# Altium schematic sheet NRF_Transciever.SchDoc: NRF_BLE_DEV_BOARD
size 420 x 297 mm; Date: 10/14/2025; Author: Nandish K K; DrawnBy: Nandish K K; Engineer: Nandish K K; Organization: github.com/Nandish-KK; Revision: A; SheetNumber: 1; SheetTotal: 1; Time: 3:41 AM
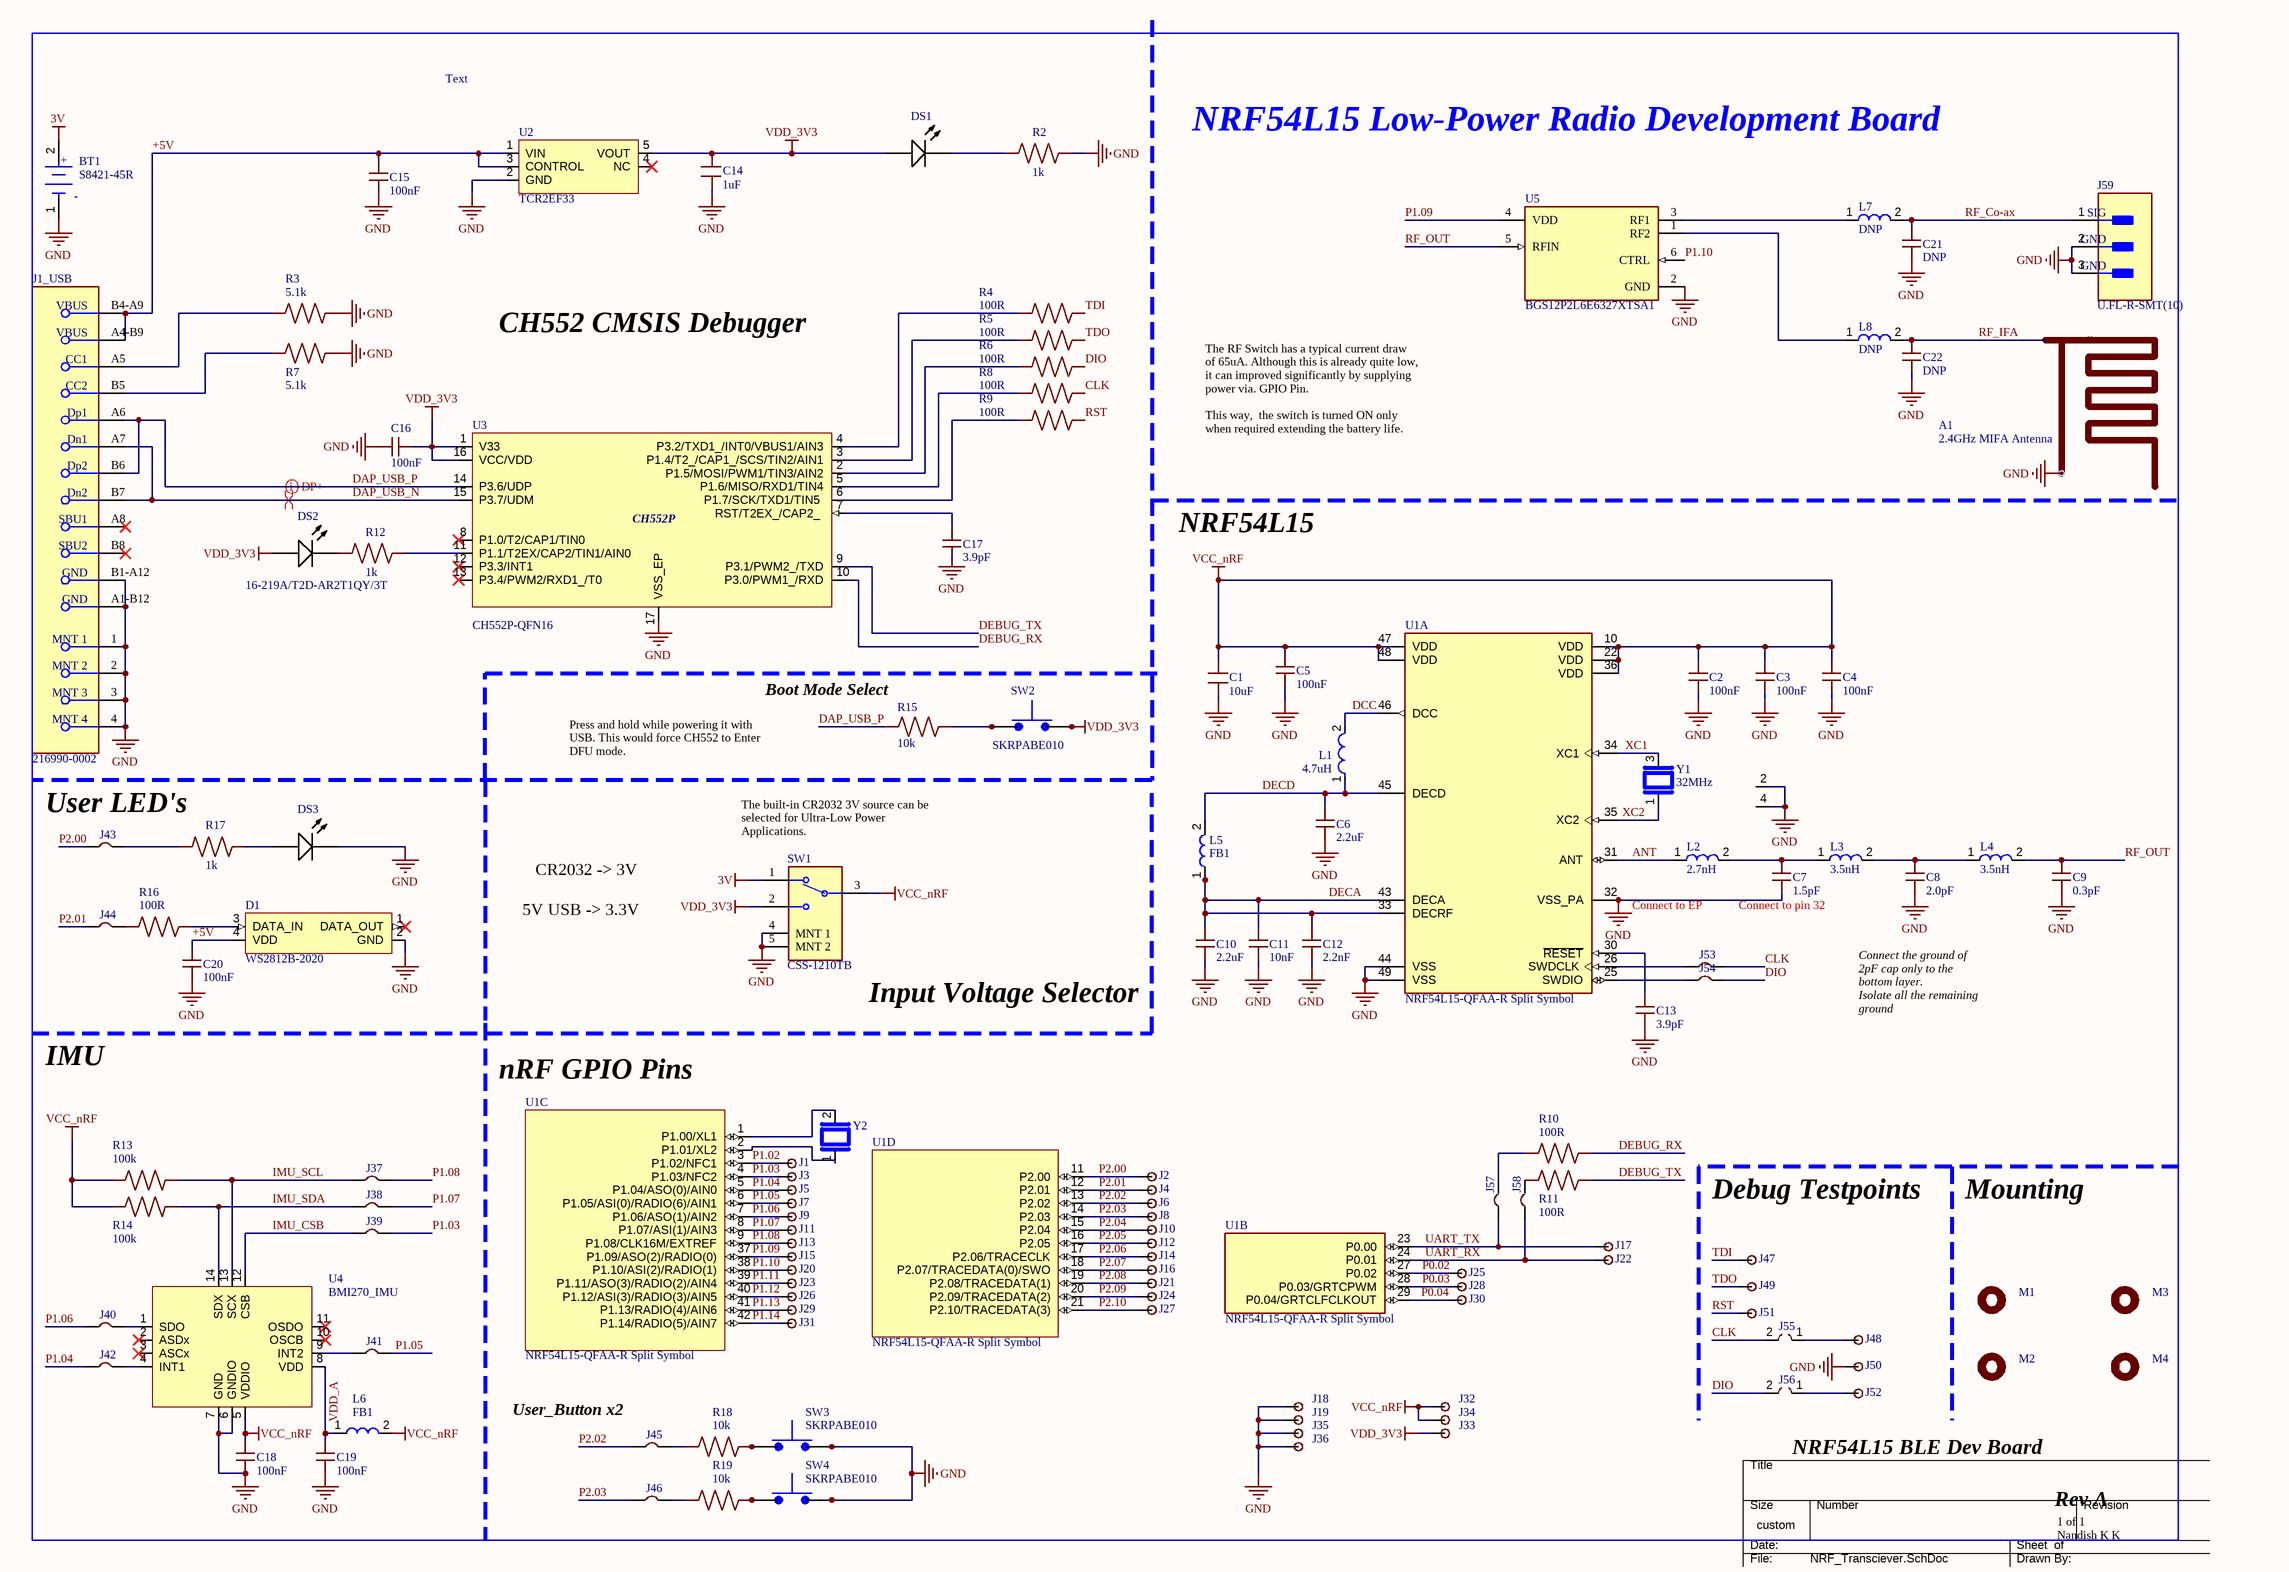
[diagram p0: NRF_Transciever.SchDoc]

## Parts
A1  2.4GHz MIFA Antenna  [2.4GHz MIFA]
BT1  S8421-45R  [FP-S8421-45R-MFG]
C1  10uF  [0402_SMD_CAPACITOR]
C2  100nF  [0201 SMD Capacitor]
C3  100nF  [0201 SMD Capacitor]
C4  100nF  [0201 SMD Capacitor]
C5  100nF  [0201 SMD Capacitor]
C6  2.2uF  [0201 SMD Capacitor]
C7  1.5pF  [0201 SMD Capacitor]
C8  2.0pF  [0201 SMD Capacitor]
C9  0.3pF  [0201 SMD Capacitor]
C10  2.2uF  [0201 SMD Capacitor]
C11  10nF  [0201 SMD Capacitor]
C12  2.2nF  [0201 SMD Capacitor]
C13  3.9pF  [0201 SMD Capacitor]
C14  1uF  [0402_SMD_CAPACITOR]
C15  100nF  [0201 SMD Capacitor]
C16  100nF  [0201 SMD Capacitor]
C17  3.9pF  [0201 SMD Capacitor]
C18  100nF  [0201 SMD Capacitor]
C19  100nF  [0201 SMD Capacitor]
C20  100nF  [0201 SMD Capacitor]
C21  DNP  [0201 SMD Capacitor]
C22  DNP  [0201 SMD Capacitor]
D1  WS2812B-2020  [ws2812b-2020]
DS1  16-219A/T2D-AR2T1QY/3T  [EVRL-0402-2_V]  (value not drawn)
DS2  16-219A/T2D-AR2T1QY/3T  [EVRL-0402-2_V]
DS3  16-219A/T2D-AR2T1QY/3T  [EVRL-0402-2_V]  (value not drawn)
J1  Single_Header_2.54mm  [Single_Header_2.54mm]  (value not drawn)
J1_USB  216990-0002  [FP-216990-0002-MFG]
J2  Single_Header_2.54mm  [Single_Header_2.54mm]  (value not drawn)
J3  Single_Header_2.54mm  [Single_Header_2.54mm]  (value not drawn)
J4  Single_Header_2.54mm  [Single_Header_2.54mm]  (value not drawn)
J5  Single_Header_2.54mm  [Single_Header_2.54mm]  (value not drawn)
J6  Single_Header_2.54mm  [Single_Header_2.54mm]  (value not drawn)
J7  Single_Header_2.54mm  [Single_Header_2.54mm]  (value not drawn)
J8  Single_Header_2.54mm  [Single_Header_2.54mm]  (value not drawn)
J9  Single_Header_2.54mm  [Single_Header_2.54mm]  (value not drawn)
J10  Single_Header_2.54mm  [Single_Header_2.54mm]  (value not drawn)
J11  Single_Header_2.54mm  [Single_Header_2.54mm]  (value not drawn)
J12  Single_Header_2.54mm  [Single_Header_2.54mm]  (value not drawn)
J13  Single_Header_2.54mm  [Single_Header_2.54mm]  (value not drawn)
J14  Single_Header_2.54mm  [Single_Header_2.54mm]  (value not drawn)
J15  Single_Header_2.54mm  [Single_Header_2.54mm]  (value not drawn)
J16  Single_Header_2.54mm  [Single_Header_2.54mm]  (value not drawn)
J17  Single_Header_2.54mm  [Single_Header_2.54mm]  (value not drawn)
J18  Single_Header_2.54mm  [Single_Header_2.54mm]  (value not drawn)
J19  Single_Header_2.54mm  [Single_Header_2.54mm]  (value not drawn)
J20  Single_Header_2.54mm  [Single_Header_2.54mm]  (value not drawn)
J21  Single_Header_2.54mm  [Single_Header_2.54mm]  (value not drawn)
J22  Single_Header_2.54mm  [Single_Header_2.54mm]  (value not drawn)
J23  Single_Header_2.54mm  [Single_Header_2.54mm]  (value not drawn)
J24  Single_Header_2.54mm  [Single_Header_2.54mm]  (value not drawn)
J25  Single_Header_2.54mm  [Single_Header_2.54mm]  (value not drawn)
J26  Single_Header_2.54mm  [Single_Header_2.54mm]  (value not drawn)
J27  Single_Header_2.54mm  [Single_Header_2.54mm]  (value not drawn)
J28  Single_Header_2.54mm  [Single_Header_2.54mm]  (value not drawn)
J29  Single_Header_2.54mm  [Single_Header_2.54mm]  (value not drawn)
J30  Single_Header_2.54mm  [Single_Header_2.54mm]  (value not drawn)
J31  Single_Header_2.54mm  [Single_Header_2.54mm]  (value not drawn)
J32  Single_Header_2.54mm  [Single_Header_2.54mm]  (value not drawn)
J33  Single_Header_2.54mm  [Single_Header_2.54mm]  (value not drawn)
J34  Single_Header_2.54mm  [Single_Header_2.54mm]  (value not drawn)
J35  Single_Header_2.54mm  [Single_Header_2.54mm]  (value not drawn)
J36  Single_Header_2.54mm  [Single_Header_2.54mm]  (value not drawn)
J37  Shorted_Solder_Bridge  [SHORTED_SOLDER_BRIDGE]  (value not drawn)
J38  Shorted_Solder_Bridge  [SHORTED_SOLDER_BRIDGE]  (value not drawn)
J39  Shorted_Solder_Bridge  [SHORTED_SOLDER_BRIDGE]  (value not drawn)
J40  Shorted_Solder_Bridge  [SHORTED_SOLDER_BRIDGE]  (value not drawn)
J41  Shorted_Solder_Bridge  [SHORTED_SOLDER_BRIDGE]  (value not drawn)
J42  Shorted_Solder_Bridge  [SHORTED_SOLDER_BRIDGE]  (value not drawn)
J43  Shorted_Solder_Bridge  [SHORTED_SOLDER_BRIDGE]  (value not drawn)
J44  Shorted_Solder_Bridge  [SHORTED_SOLDER_BRIDGE]  (value not drawn)
J45  Shorted_Solder_Bridge  [SHORTED_SOLDER_BRIDGE]  (value not drawn)
J46  Shorted_Solder_Bridge  [SHORTED_SOLDER_BRIDGE]  (value not drawn)
J47  Single_Header_2.54mm  [Single_Header_2.54mm]  (value not drawn)
J48  Single_Header_2.54mm  [Single_Header_2.54mm]  (value not drawn)
J49  Single_Header_2.54mm  [Single_Header_2.54mm]  (value not drawn)
J50  Single_Header_2.54mm  [Single_Header_2.54mm]  (value not drawn)
J51  Single_Header_2.54mm  [Single_Header_2.54mm]  (value not drawn)
J52  Single_Header_2.54mm  [Single_Header_2.54mm]  (value not drawn)
J53  Shorted_Solder_Bridge  [SHORTED_SOLDER_BRIDGE]  (value not drawn)
J54  Shorted_Solder_Bridge  [SHORTED_SOLDER_BRIDGE]  (value not drawn)
J55  Open_Solder_Bridge  [Open_Solder_bridge]  (value not drawn)
J56  Open_Solder_Bridge  [Open_Solder_bridge]  (value not drawn)
J57  Shorted_Solder_Bridge  [SHORTED_SOLDER_BRIDGE]  (value not drawn)
J58  Shorted_Solder_Bridge  [SHORTED_SOLDER_BRIDGE]  (value not drawn)
J59  U.FL-R-SMT(10)  [FP-U_FL-R-SMT_10-MFG]
L1  4.7uH  [FP-MLZ1608-IPC_A]
L2  2.7nH  [0201_SMD_INDUCTOR]
L3  3.5nH  [0201_SMD_INDUCTOR]
L4  3.5nH  [0201_SMD_INDUCTOR]
L5  FB1  [0201_SMD_INDUCTOR]
L6  FB1  [0201_SMD_INDUCTOR]
L7  DNP  [0201_SMD_INDUCTOR]
L8  DNP  [0201_SMD_INDUCTOR]
M1  M2_Mounting_Hole  [M2 Mounting hole]  (value not drawn)
M2  M2_Mounting_Hole  [M2 Mounting hole]  (value not drawn)
M3  M2_Mounting_Hole  [M2 Mounting hole]  (value not drawn)
M4  M2_Mounting_Hole  [M2 Mounting hole]  (value not drawn)
R2  1k  [RES_0402_Generic]
R3  5.1k  [RES_0402_Generic]
R4  100R  [RES_0402_Generic]
R5  100R  [RES_0402_Generic]
R6  100R  [RES_0402_Generic]
R7  5.1k  [RES_0402_Generic]
R8  100R  [RES_0402_Generic]
R9  100R  [RES_0402_Generic]
R10  100R  [RES_0402_Generic]
R11  100R  [RES_0402_Generic]
R12  1k  [RES_0402_Generic]
R13  100k  [RES_0402_Generic]
R14  100k  [RES_0402_Generic]
R15  10k  [RES_0402_Generic]
R16  100R  [RES_0402_Generic]
R17  1k  [RES_0402_Generic]
R18  10k  [RES_0402_Generic]
R19  10k  [RES_0402_Generic]
SW1  CSS-1210TB  [FP-CSS-1210TB-MFG]
SW2  SKRPABE010  [SW_SKRPABE010]
SW3  SKRPABE010  [SW_SKRPABE010]
SW4  SKRPABE010  [SW_SKRPABE010]
U1  NRF54L15-QFAA-R Split Symbol  [NRF54L15_LQFN_48]  (parts A,B,C,D of 4)
U2  TCR2EF33  [TCR2EF33-SOT-23-5]
U3  CH552P-QFN16  [CH552-QFN16_3x3]
U4  BMI270_IMU  [BMI_270_PQFN50P300X250X70-14L]
U5  BGS12P2L6E6327XTSA1  [FP-PG-TSLP-6-MFG]
Y1  32MHz  [OSC_XRCGB32M000F2P01R0]
Y2  CM8V-T1A-32.768KHZ-9PF-20PPM-TA-QC  [XTAL_CM8V-T1A-32.768KHZ-9PF-20PPM-TA-QC]  (value not drawn)

## Nets
3V: BT1.2(A) SW1.1
GND: A1.2(GND) BT1.1(C) C1.1 C2.1 C3.1 C4.1 C5.1 C6.1 C7.1 C8.1 C9.1 C10.1 C11.1 C12.1 C13.1 C14.1 C15.1 C16.1 C17.1 C18.1 C19.1 C20.1 C21.1 C22.1 D1.2(GND) DS3.2(K) J1_USB.1(MNT_1) J1_USB.2(MNT_2) J1_USB.3(MNT_3) J1_USB.4(MNT_4) J1_USB.A1-B12(GND) J1_USB.B1-A12(GND) J18.1 J19.1 J35.1 J36.1 J50.1 J59.2(GND) J59.3(GND) R2.1 R3.1 R7.1 SW1.4(MNT_1) SW1.5(MNT_2) SW3.3 SW3.4 SW4.3 SW4.4 U1.32(VSS_PA) U1.44(VSS) U1.49(VSS) U2.2(GND) U3.17(VSS_EP) U4.6(GNDIO) U4.7(GND) U5.2(GND) Y1.2 Y1.4
VCC_nRF: C1.2 C2.2 C3.2 C4.2 C5.2 C18.2 J32.1 J34.1 L6.2 R13.2 R14.2 SW1.3(C) U1.10(VDD) U1.22(VDD) U1.36(VDD) U1.47(VDD) U1.48(VDD) U4.5(VDDIO)
VDD_3V3: C14.2 C16.2 DS1.1(A) DS2.1(A) J33.1 SW1.2 SW2.3 SW2.4 U2.5(VOUT) U3.1(V33) U3.16(VCC/VDD)
+5V: C15.2 C20.2 D1.4(VDD) J1_USB.A4-B9(VBUS) J1_USB.B4-A9(VBUS) U2.1(VIN) U2.3(CONTROL)
ANT: L2.1 U1.31(ANT)
CLK: J53.2 J55.2 R8.2
DAP_USB_N: J1_USB.A7(Dn1) J1_USB.B7(Dn2) U3.15(P3.7/UDM)
DAP_USB_P: J1_USB.A6(Dp1) J1_USB.B6(Dp2) R15.1 U3.14(P3.6/UDP)
DCC: L1.2 U1.46(DCC)
DEBUG_RX: R10.1 U3.10(P3.0/PWM1_/RXD)
DEBUG_TX: R11.2 U3.9(P3.1/PWM2_/TXD)
DECA: C10.2 C11.2 C12.2 L5.1 U1.33(DECRF) U1.43(DECA)
DECD: C6.2 L1.1 L5.2 U1.45(DECD)
DIO: J54.2 J56.2 R6.2
IMU_CSB: J39.1 U4.12(CSB)
IMU_SCL: J37.1 R13.1 U4.13(SCX)
IMU_SDA: J38.1 R14.1 U4.14(SDX)
P0.02: J25.1 U1.27(P0.02)
P0.03: J28.1 U1.28(P0.03/GRTCPWM)
P0.04: J30.1 U1.29(P0.04/GRTCLFCLKOUT)
P1.02: J1.1 U1.3(P1.02/NFC1)
P1.03: J3.1 J39.2 U1.4(P1.03/NFC2)
P1.04: J5.1 J42.1 U1.5(P1.04/ASO(0)/AIN0)
P1.05: J7.1 J41.2 U1.6(P1.05/ASI(0)/RADIO(6)/AIN1)
P1.06: J9.1 J40.1 U1.7(P1.06/ASO(1)/AIN2)
P1.07: J11.1 J38.2 U1.8(P1.07/ASI(1)/AIN3)
P1.08: J13.1 J37.2 U1.9(P1.08/CLK16M/EXTREF)
P1.09: J15.1 U1.37(P1.09/ASO(2)/RADIO(0)) U5.4(VDD)
P1.10: J20.1 U1.38(P1.10/ASI(2)/RADIO(1)) U5.6(CTRL)
P1.11: J23.1 U1.39(P1.11/ASO(3)/RADIO(2)/AIN4)
P1.12: J26.1 U1.40(P1.12/ASI(3)/RADIO(3)/AIN5)
P1.13: J29.1 U1.41(P1.13/RADIO(4)/AIN6)
P1.14: J31.1 U1.42(P1.14/RADIO(5)/AIN7)
P2.00: J2.1 J43.1 U1.11(P2.00)
P2.01: J4.1 J44.1 U1.12(P2.01)
P2.02: J6.1 J45.1 U1.13(P2.02)
P2.03: J8.1 J46.1 U1.14(P2.03)
P2.04: J10.1 U1.15(P2.04)
P2.05: J12.1 U1.16(P2.05)
P2.06: J14.1 U1.17(P2.06/TRACECLK)
P2.07: J16.1 U1.18(P2.07/TRACEDATA(0)/SWO)
P2.08: J21.1 U1.19(P2.08/TRACEDATA(1))
P2.09: J24.1 U1.20(P2.09/TRACEDATA(2))
P2.10: J27.1 U1.21(P2.10/TRACEDATA(3))
RF_Co-ax: C21.2 J59.1(SIG) L7.2
RF_IFA: A1.1(RF_IN) C22.2 L8.2
RF_OUT: C9.2 L4.2 U5.5(RFIN)
RST: J51.1 R9.2
TDI: J47.1 R4.2
TDO: J49.1 R5.2
UART_RX: J22.1 J58.1 U1.24(P0.01)
UART_TX: J17.1 J57.1 U1.23(P0.00)
VDD_A: C19.2 L6.1 U4.8(VDD)
XC1: U1.34(XC1) Y1.3
XC2: U1.35(XC2) Y1.1
NetC7_2: C7.2 L2.2 L3.1
NetC8_2: C8.2 L3.2 L4.1
NetC13_2: C13.2 U1.30(~{RESET})
NetC17_2: C17.2 U3.7(RST/T2EX_/CAP2_)
NetD1_3: D1.3(DATA_IN) R16.2
NetDS1_2: DS1.2(K) R2.2
NetDS2_2: DS2.2(K) R12.2
NetDS3_1: DS3.1(A) R17.1
NetJ1_USB_A5: J1_USB.A5(CC1) R3.2
NetJ1_USB_B5: J1_USB.B5(CC2) R7.2
NetJ40_2: J40.2 U4.1(SDO)
NetJ41_1: J41.1 U4.9(INT2)
NetJ42_2: J42.2 U4.4(INT1)
NetJ43_2: J43.2 R17.2
NetJ44_2: J44.2 R16.1
NetJ45_2: J45.2 R18.2
NetJ46_2: J46.2 R19.2
NetJ48_1: J48.1 J55.1
NetJ52_1: J52.1 J56.1
NetJ53_1: J53.1 U1.26(SWDCLK)
NetJ54_1: J54.1 U1.25(SWDIO)
NetJ57_2: J57.2 R10.2
NetJ58_2: J58.2 R11.1
NetL7_1: L7.1 U5.3(RF1)
NetL8_1: L8.1 U5.1(RF2)
NetR4_1: R4.1 U3.4(P3.2/TXD1_/INT0/VBUS1/AIN3)
NetR5_1: R5.1 U3.3(P1.4/T2_/CAP1_/SCS/TIN2/AIN1)
NetR6_1: R6.1 U3.2(P1.5/MOSI/PWM1/TIN3/AIN2)
NetR8_1: R8.1 U3.5(P1.6/MISO/RXD1/TIN4)
NetR9_1: R9.1 U3.6(P1.7/SCK/TXD1/TIN5)
NetR12_1: R12.1 U3.11(P1.1/T2EX/CAP2/TIN1/AIN0)
NetR15_2: R15.2 SW2.1 SW2.2
NetR18_1: R18.1 SW3.1 SW3.2
NetR19_1: R19.1 SW4.1 SW4.2
NetU1_1: U1.1(P1.00/XL1) Y2.2
NetU1_2: U1.2(P1.01/XL2) Y2.1

Not connected (* = marked no-connect by the designer): D1 1(DATA_OUT)*; J1_USB A8(SBU1)* B8(SBU2)*; U2 4(NC)*; U3 8(P1.0/T2/CAP1/TIN0)* 12(P3.3/INT1)* 13(P3.4/PWM2/RXD1_/T0_)*; U4 2(ASDx)* 3(ASCx)* 10(OSCB)* 11(OSDO)*

## Layout directives
differential pair: DAP_USB_N, DAP_USB_P

## Notes on the sheet
- Text
- NRF54L15 Low-Power Radio Development Board
- CH552 CMSIS Debugger
- The RF Switch has a typical current draw of 65uA. Although this is already quite low, it can improved significantly by supplying power via. GPIO Pin.
  This way,  the switch is turned ON only when required extending the battery life.
- NRF54L15
- (near R15) Boot Mode Select
- Press and hold while powering it with USB. This would force CH552 to Enter DFU mode.
- User LED's
- (near SW1) The built-in CR2032 3V source can be selected for Ultra-Low Power Applications.
- 5V USB -> 3.3V
- CR2032 -> 3V
- Connect to EP
- (near C7) Connect to pin 32
- Input Voltage Selector
- Connect the ground of 2pF cap only to the bottom layer.
  Isolate all the remaining ground
- IMU
- nRF GPIO Pins
- Debug Testpoints
- Mounting
- (near J45) User_Button x2
- NRF54L15 BLE Dev Board
- Rev A
- 1 of 1
- Nandish K K
- THIS DOCUMENT AND THE DATA DISCLOSED HEREIN OR
- HEREWITH IS THE PROPERTY OF ALTIUM LIMITED AND MAY
- DWG NO:
- REVISION
- REV:
- DESCRIPTION
- DATE
- APPROVED
- BE FREELY DISTRIBUTED IN WHOLE. NO RIGHTS ARE
- RESERVED OR EXPRESS OR IMPLIED WARANTEE GIVEN.
- ENG:
- APPROVALS
- PROJECT
- DSN:
- CHK:
- REFERENCE DOCUMENTS
- PROJECT REVISION:
- TITLE
- DOCUMENT REVISION:
- DESIGN ITEM:
- BOM:
- FAB DWG:
- PCB DWG:
- ASSY DWG:
- SCALE:
- A3
- SIZE
- CAGE CODE
- FILE NAME
- DWG NO.
- SHEET
- OF
- REV
- (in symbol CH552P-QFN16) CH552P
- (in symbol CMP-2000-07028-3) +; -

## Library data of the parts
A1 = 2.4GHz MIFA: 2.4GHz Meandered Inverted F Antenna from Cypress appnote AN91445
BT1 = CMP-2000-07028-3: BATTERY HOLDER COIN 20MM SMD; Number of Cells: 1; Min Operating Temperature: -40°C; Packaging: Tape and Reel; Max Operating Temperature: 105°C; Number of Batteries: 1; Package Quantity: 500; Material: Polyphenylene; Case/Package: SMD/SMT; Mount: Surface Mount; REACH SVHC: No SVHC; Contact Plating: Bronze; Termination: SMD/SMT
C1 C14 = CAP_0402: Capacitor SMD 0402 Generic
C2-C13 C15-C22 = CAP_0201: Capacitor SMD 0201 Generic
D1 = WS2812B-2020: RGB LED (Built-in IC) 2x2mm SMD
DS1-DS3 = CMP-007-00000-2: Chip LED, White, 5 V, 10 mA, 30 mW, -40 to 85 degC, 2-Pin SMD (0402), RoHS, Tape and Reel; Manufacturer: Everlight Electronics; Luminous Intensity: 360mcd; Forward Voltage: 2.6V; Viewing Angle: 130degrees; Power: 30mW; Forward Current: 5mA; Package Quantity: 3000; Max Operating Temperature: 85°C; Datasheet Version: Rev. 5, 04/2013; Datasheet URL: http://www.everlight.com/file/ProductFile/16-219A-T2D-AR2T1QY-3T.pdf; Package Reference: 0402; Mounting Technology: SM; Case/Package: 0402; Illumination Colour: White; Manufacturer URL: http://www.everlight.com/; Package Description: 2-Pin Surface Mount Device, Body 1 x 0.5 mm; RoHS Compliant: True; Packaging: TapeandReel; Min Operating Temperature: -40°C
J1_USB = CMP-04767-000018-1: CONN RCP USB2.0 TYP C 24P SMD RA
J59 = CMP-0029-00003-2: CONN U.FL RCPT STR 50 OHM SMD; Plating: Silver; Connector Type: Coaxial; Frequency: 6GHz; Impedance: 50R; Body Material: Bronze; Dielectric Material: Polymer; Contact Plating: Gold; Termination: Solder; Orientation: Vertical; Contact Material: Brass; Min Operating Temperature: -40°C; Mount: Surface Mount; Lead Free: Lead Free; Max Operating Temperature: 90°C; Radiation Hardening: No; Packaging: Tape and Reel; Body Plating: Silver; Fastening Type: Snap; Max Frequency: 6GHz; Depth: 3.1mm; Package Quantity: 1; Case/Package: SMD/SMT; Housing Color: Beige; Length: 3mm
L1 = CMP-08253-000311-1: Shielded Multilayer Inductor 4.7uH ±20% 350mA 650mΩ SMD 0603; DC Resistance (DCR): 650mR; Test Frequency: 2MHz; Self Resonant Frequency: 80MHz; Core Material: Ferrite; Saturation Current: 120mA; Packaging: Tape and Reel; Width: 0.031inch; Height - Seated (Max): 0.037inch; Inductance: 4.7uH; Current Rating: 350mA; Max Operating Temperature: 125°C; Tolerance: 20%; Length: 0.063inch; Package Quantity: 4000; Case/Package: 0603; Case Code (Imperial): 0603; Min Operating Temperature: -55°C; Case Code (Metric): 1608; RoHS Compliant: Yes; Shielding: Shielded; Mount: Surface Mount
L2-L8 = INDUCTOR_0201: Inductor SMD 0201 Generic
M1-M4 = M2_Mounting_Hole: M2 Screw mounting hole. / Actual dia. 2.2 mm
R2-R19 = RES_0402: Resistor SMD 0402 Generic
SW1 = CMP-71745-000010-1: SWITCH SLIDE SPDT 100MA 12V; Actuator Material: Polymer; Switch Travel: 2mm; Number of Positions: 2; Contact Style: Non-Shorting; Operating Force: 357gf; Switch Function: On-On; Electrical Life: 10000Cycles; Number of Poles: 1; Actuator Type: Standard; Termination: Gull Wing; Contact Plating: Gold; Voltage Rating (DC): 12V; RoHS Compliant: Yes; Packaging: Tape and Reel; Max Operating Temperature: 70°C; Throw Configuration: SPDT; Case/Package: SMD/SMT; Contact Current Rating: 100mA; Actuator Length: 2mm; Mount: Surface Mount; Min Operating Temperature: -20°C; Max Voltage Rating (DC): 12V; Series: CSS; Orientation: Right Angle; Contact Material: Copper Alloy; Radiation Hardening: No; Current Rating: 100mA
SW2-SW4 = CMP-015-000000-1: Switch Tactile N.O. SPST Button J-Bend 0.05A 16VDC 1.57N SMD Automotive T/R; MF: ALPS; MP: SKRPABE010; Design Item ID: SKRPABE010; Component Type: Standard; Package: None; Check_prices: https://www.snapeda.com/parts/SKRPABE010/ALPS/view-part/?ref=eda; SnapEDA_Link: https://www.snapeda.com/parts/SKRPABE010/ALPS/view-part/?ref=snap; Pin Count: 4; Source: SKRPABE010.SchLib; Value: *
U1 = NRF54L15-QFAA-R: MF: {'manufacturer': u'Nordic Semiconductor ASA'}; Price: None; Value: *; MP: NRF54L15-QFAA-R; Availability: Unavailable; Package: None; Component Type: Standard; Design Item ID: NRF54L15-QFAA-R; Source: NRF54L15-QFAA-R.SchLib; Pin Count: 49
U4 = BMI270_IMU: 6-axis IMU
U5 = CMP-32859-000004-1: CMOS SWITCH
Y1 = CMP-005-000000-1: 32MHz Â±20ppm Crystal 8pF 100 Ohms 4-SMD, No Lead; MF: Murata Electronics; Component Type: Standard; Source: XRCGB32M000F2P01R0.SchLib; SnapEDA_Link: https://www.snapeda.com/parts/XRCGB32M000F2P01R0/Murata%20Electronics%20North%20America/view-part/3227036/?ref=snap; Value: *; Pin Count: 2; Design Item ID: XRCGB32M000F2P01R0; Check_prices: https://www.snapeda.com/parts/XRCGB32M000F2P01R0/Murata%20Electronics%20North%20America/view-part/3227036/?ref=eda; MP: XRCGB32M000F2P01R0; Price: None; Package: SMD-4 Murata; Availability: In Stock
Y2 = CMP-007-000000-1: Tuning Fork Crystal 32.768kHz in 1.2 x 2.0mm package; MF: Micro Crystal; Check_prices: https://www.snapeda.com/parts/CM8V-T1A-32.768KHZ-9PF-20PPM-TA-QC/Micro+Crystal/view-part/?ref=eda; Value: *; Source: CM8V-T1A-32.768KHZ-9PF-20PPM-TA-QC.SchLib; SnapEDA_Link: https://www.snapeda.com/parts/CM8V-T1A-32.768KHZ-9PF-20PPM-TA-QC/Micro+Crystal/view-part/?ref=snap; Package: SMD-2 Micro Crystal; MP: CM8V-T1A-32.768KHZ-9PF-20PPM-TA-QC; Design Item ID: CM8V-T1A-32.768KHZ-9PF-20PPM-TA-QC; Component Type: Standard; Pin Count: 2